# EAGLE design Grove_IMU 9DOF v1.0 (EAGLE 6.4)
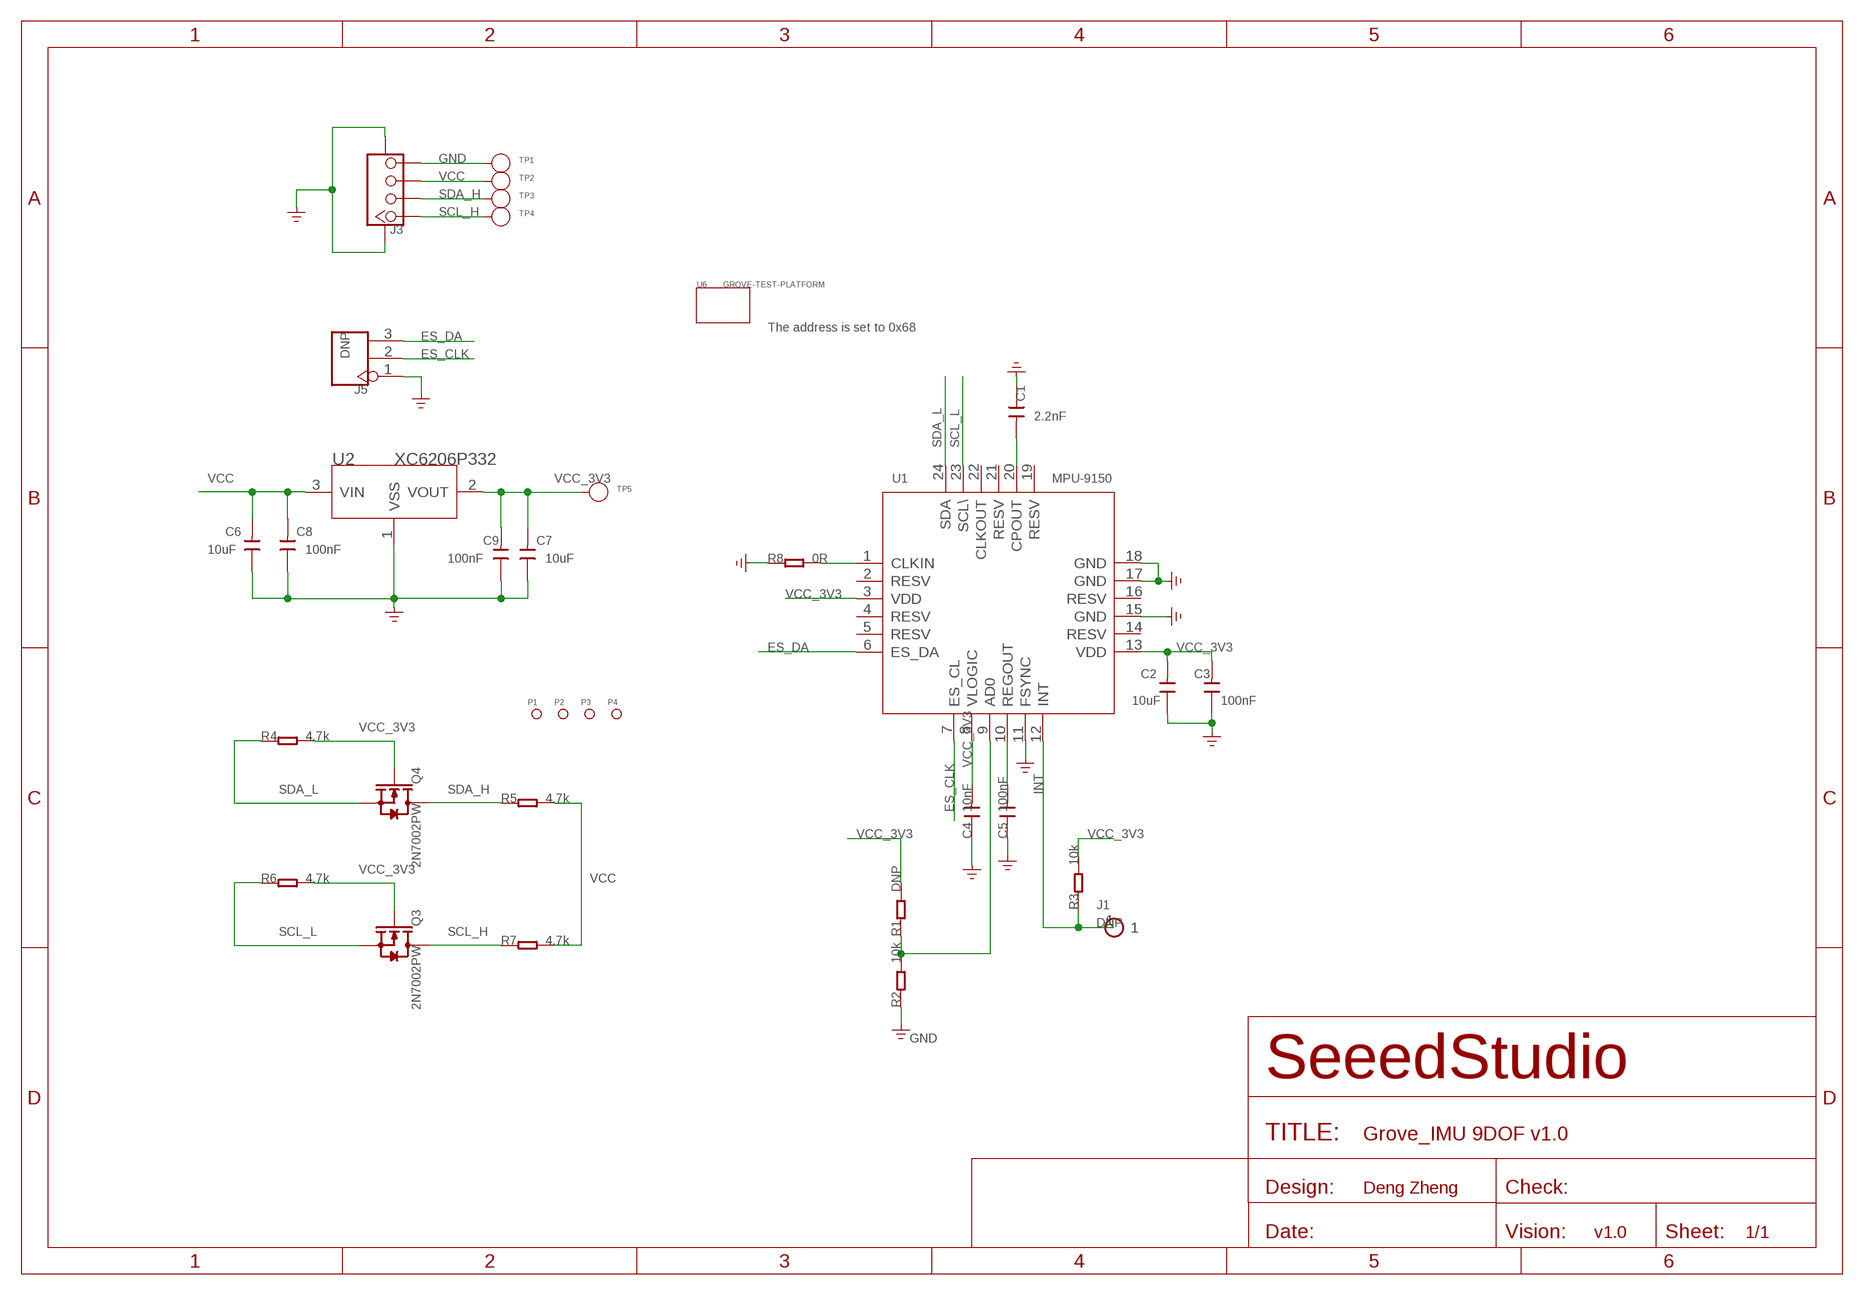
[diagram p0: schematic, sheet 1]

## Parts
C1  2.2nF  C-0603  [C0603]
C2  10uF  C-0805  [C0805]
C3  100nF  C-0603  [C0603]
C4  10nF  C-0603  [C0603]
C5  100nF  C-0603  [C0603]
C6  10uF  C-0805  [C0805]
C7  10uF  C-0805  [C0805]
C8  100nF  C-0603  [C0603]
C9  100nF  C-0603  [C0603]
J1  DNP  HEADER-1P-35  [1P-65/35MIL]
J3  TWIG-4P-2.0-SMD-FEMALE-REINFORCE'90D'  [4P-SMD-2.0-90D]
J5  DNP  HEADER-3P-2.54  [3P-2.54]
P1  PAD-MARK  [ROUND-MARK-1.0]
P2  PAD-MARK  [ROUND-MARK-1.0]
P3  PAD-MARK  [ROUND-MARK-1.0]
P4  PAD-MARK  [ROUND-MARK-1.0]
Q3  2N7002PW  MOSFET-N'SI1304BDL'  [SOT323]
Q4  2N7002PW  MOSFET-N'SI1304BDL'  [SOT323]
R1  DNP  R-0603  [R0603]
R2  10k  R-0603  [R0603]
R3  10k  R-0603  [R0603]
R4  4.7k  R-0603  [R0603]
R5  4.7k  R-0603  [R0603]
R6  4.7k  R-0603  [R0603]
R7  4.7k  R-0603  [R0603]
R8  0R  R-0603  [R0603]
TP1  PAD-TEST-POINT'4545'  [TP_4545]
TP2  PAD-TEST-POINT'4545'  [TP_4545]
TP3  PAD-TEST-POINT'4545'  [TP_4545]
TP4  PAD-TEST-POINT'4545'  [TP_4545]
TP5  PAD-TEST-POINT'4545'  [TP_4545]
U1  MPU-9150  [LGA-24]
U2  XC6206P332  XC6206MR  [SOT23]
U6  GROVE-TEST-PLATFORM  TWIG'2U'  [GROVE-TEST-PLATFORM]

## Nets
ES_CLK: J5.2 U1.7(ES_CL)
ES_DA: J5.3 U1.6(ES_DA)
GND: C1.1 C2.1 C3.1 C4.1 C5.1 C6.1 C7.1 C8.1 C9.1 J3.4 J3.SS1 J3.SS2 J5.1 R8.1 TP1.T U1.11(FSYNC) U1.15(GND) U1.17(GND) U1.18(GND) U2.1(VSS)
INT: J1.1 R3.1 U1.12(INT)
N$1: R1.1 R2.2 U1.9(AD0)
N$2: C1.2 U1.20(CPOUT)
N$4: R8.2 U1.1(CLKIN)
N$5: C5.2 U1.10(REGOUT)
SCL_H: J3.1 Q3.3(D) R7.1 TP4.T
SCL_L: Q3.2(S) R6.1 U1.23(SCL\)
SDA_H: J3.2 Q4.3(D) R5.1 TP3.T
SDA_L: Q4.2(S) R4.1 U1.24(SDA)
VCC: C6.2 C8.2 J3.3 R5.2 R7.2 TP2.T U2.3(VIN)
VCC_3V3: C2.2 C3.2 C4.2 C7.2 C9.2 Q3.1(G) Q4.1(G) R1.2 R3.2 R4.2 R6.2 TP5.T U1.3(VDD) U1.8(VLOGIC) U1.13(VDD) U2.2(VOUT)
Unconnected: R2.1 U1.2(RESV) U1.4(RESV) U1.5(RESV) U1.14(RESV) U1.16(RESV) U1.19(RESV) U1.21(RESV) U1.22(CLKOUT)

## Notes on the sheet
- The address is set to 0x68
- Deng Zheng
- v1.0

## Library data of the parts
C1-C9 = Discrete:C*: Ceramic Capacitors
J1 = Connector :HEADER-1P
J3 = Connector :TWIG-4P-2.0-SMD-FEMALE-REINFORCE
J5 = Connector :HEADER-3P
P1-P4 = Discrete:PAD-MARK; PARTNO: DNP
Q3 Q4 = Discrete:MOSFET-N: IRLL014: http://www.vishay.com/docs/91319/sihll014.pdf
R1-R8 = Discrete:R*
TP1-TP5 = Discrete:PAD-TEST-POINT; PARTNO: DNP
U1 = template:MPU-9150
U2 = IC:XC6206: LOW ESR Cap.Compatible Positive Voltage Regulators
U6 = template:TWIG

## Net classes
0 default: width 0.152 mm, drill 0.305 mm, clearance 0.152 mm
1 GND: width 0.152 mm, drill 0.305 mm, clearance 0.152 mm to class 0, clearance 0.152 mm

## Board
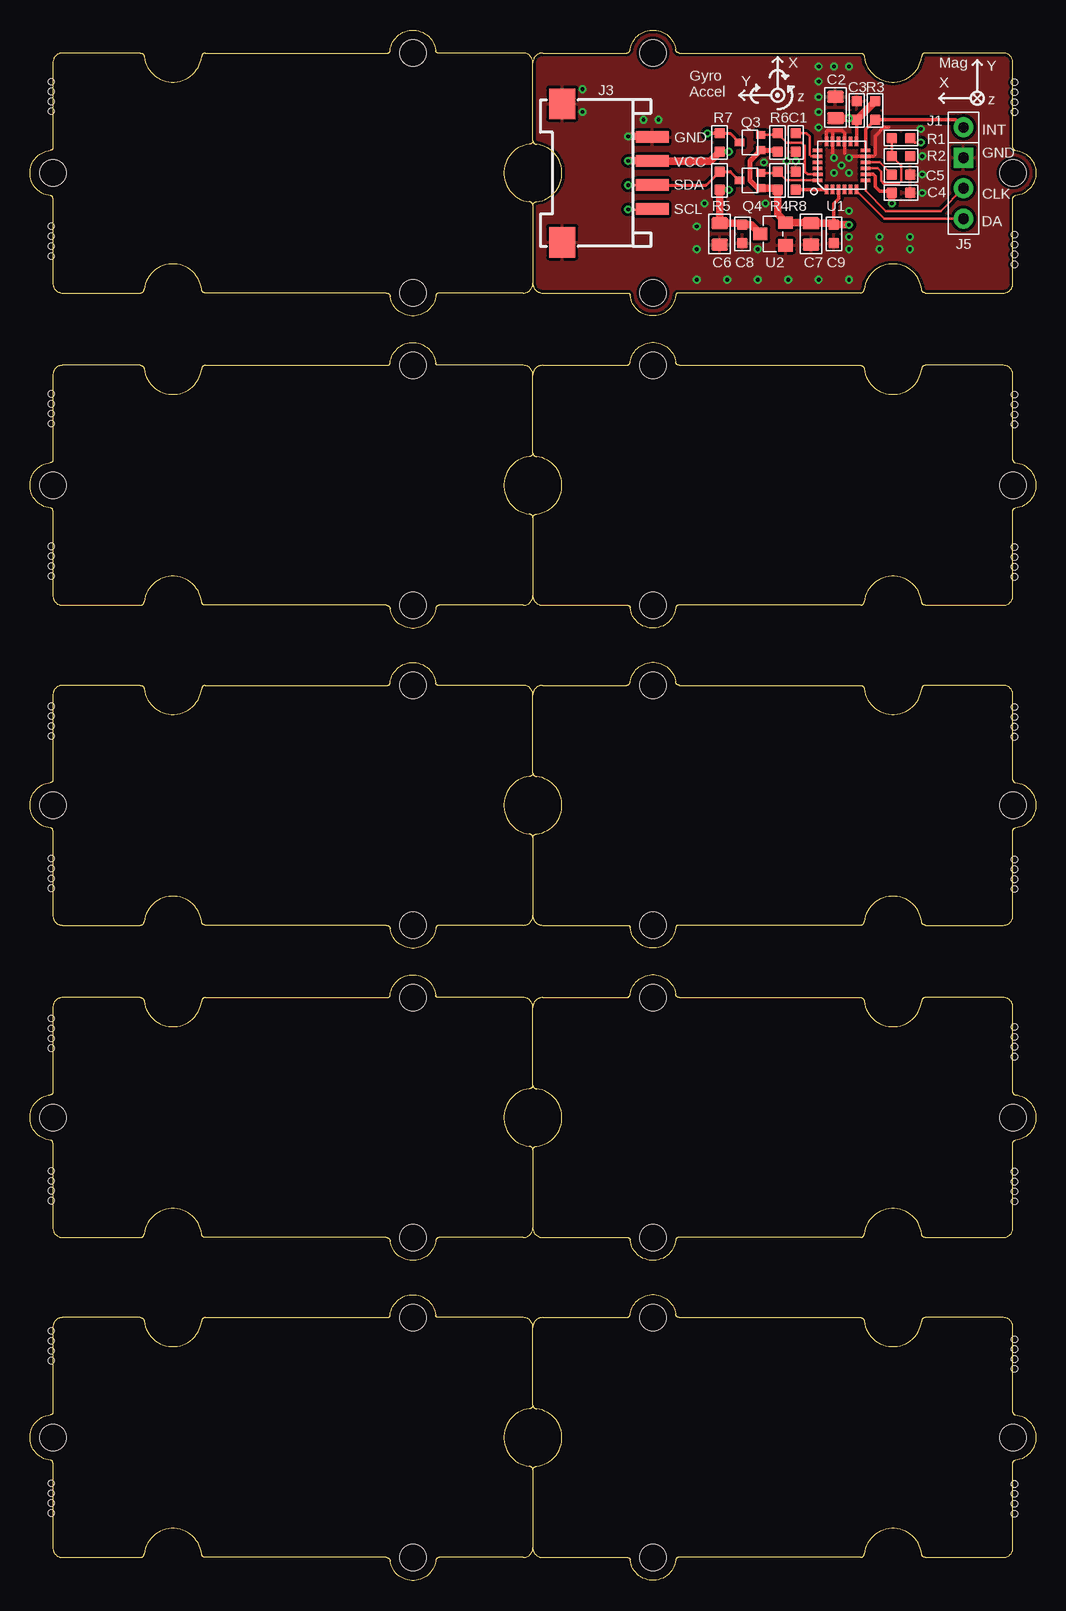
[diagram p1: board, top side]
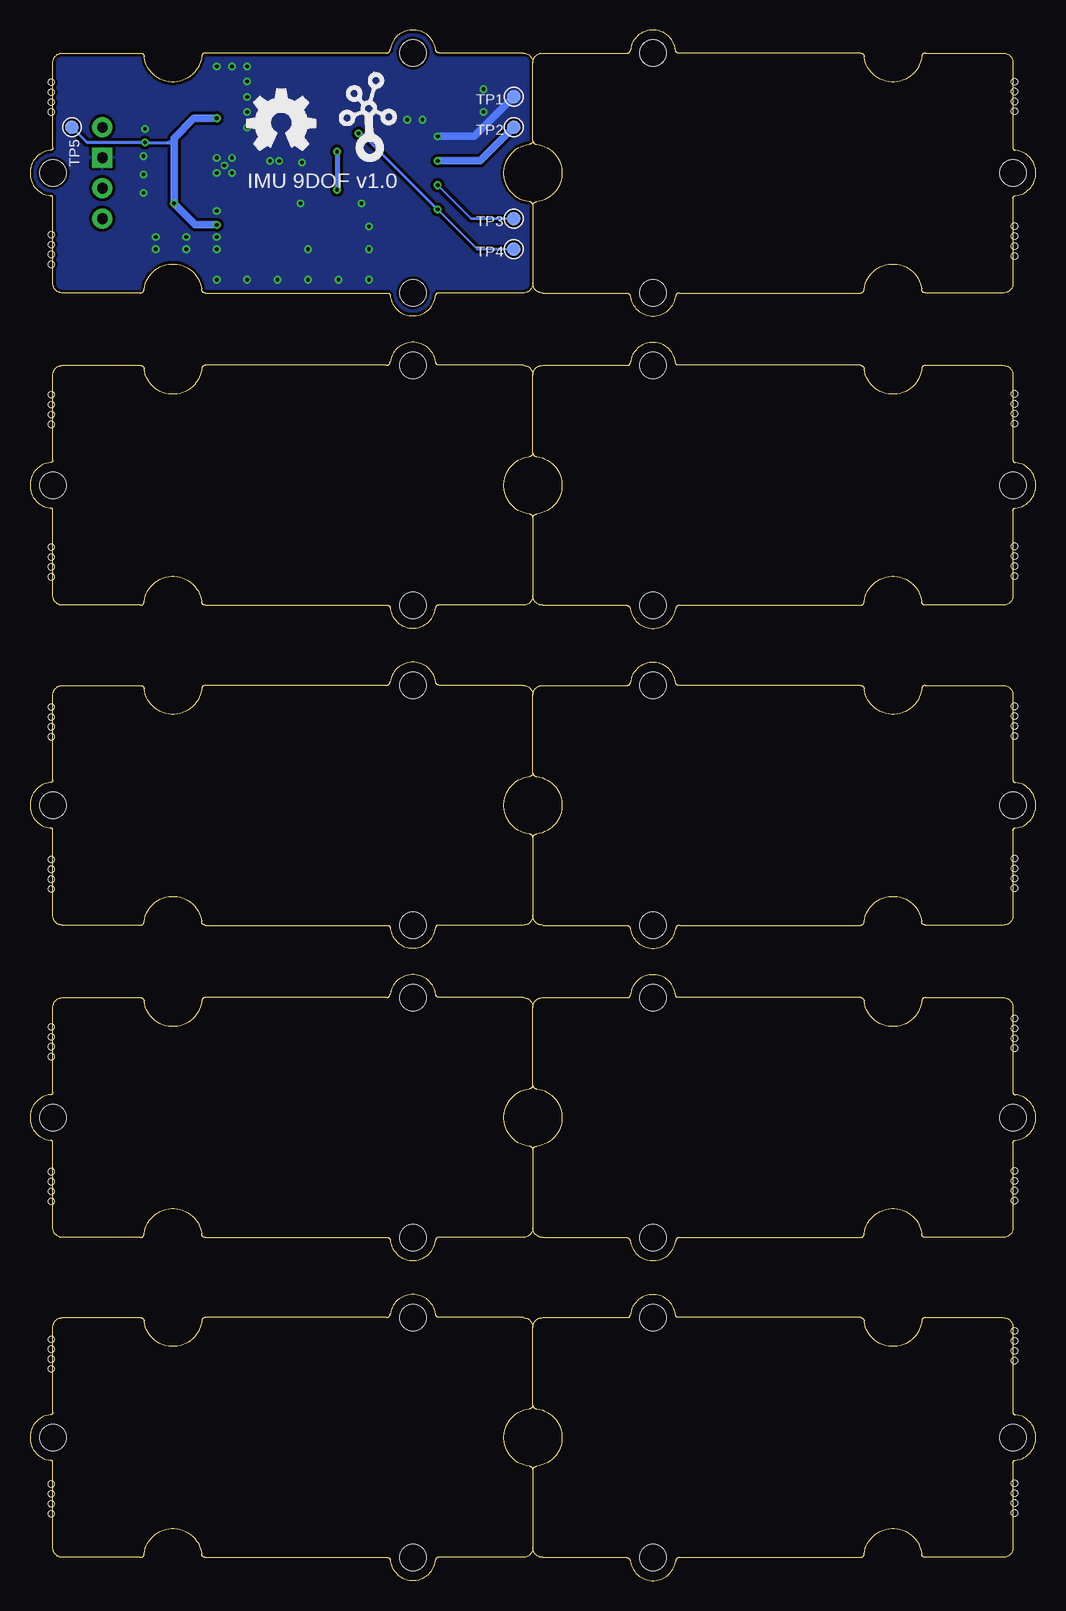
[diagram p2: board, bottom side, seen from below]

Size 83.82 x 129.25 mm. Coordinates in mm from the lower left corner, seen from the top.
Copper layers (1*16): Top 0.035mm / dielectric 1.5mm / Bottom 0.035mm
Design rules "SeeedStudio_rule_no_angle_090911 *": minimum track width 6mil, minimum drill 12mil, track to track 6mil, track to pad 6mil, pad to pad 6mil, via to via 6mil, smd to smd 0mil, copper to edge 10mil, drill to drill 10mil, minimum pad ring 10mil, minimum via ring 6mil, stop-mask expansion 2mil, vias tented up to drill 100mil, thermal gap 10mil
Holes 0.5 mm at 1.78,34.15 1.78,31.67 1.78,32.5 1.78,33.32 1.78,46.85 1.78,44.37 1.78,45.2 1.78,46.02 1.78,60.18 1.78,57.7 1.78,58.53 1.78,59.36 1.78,72.88 1.78,70.4 1.78,71.23 1.78,72.06 1.78,86.22 1.78,83.74 1.78,84.57 1.78,85.39 1.78,98.92 1.78,96.44 1.78,97.27 1.78,98.09 1.78,112.89 1.78,110.41 1.78,111.24 1.78,112.06 1.78,124.95 1.78,122.47 1.78,123.3 1.78,124.13 82.04,122.41 82.04,124.89 82.04,124.06 82.04,123.24 82.04,109.71 82.04,112.19 82.04,111.36 82.04,110.54 82.04,96.38 82.04,98.85 82.04,98.03 82.04,97.2 82.04,83.68 82.04,86.15 82.04,85.33 82.04,84.5 82.04,70.34 82.04,72.82 82.04,71.99 82.04,71.17 82.04,57.64 82.04,60.12 82.04,59.29 82.04,58.47 82.04,43.67 82.04,46.15 82.04,45.32 82.04,44.5 82.04,31.61 82.04,34.08 82.04,33.26 82.04,32.43 1.78,8.11 1.78,5.63 1.78,6.46 1.78,7.29 1.78,20.81 1.78,18.33 1.78,19.16 1.78,19.99 82.04,17.64 82.04,20.11 82.04,19.29 82.04,18.46 82.04,5.57 82.04,8.05 82.04,7.22 82.04,6.4
Holes 1.91 mm at -4.13,3.67 87.95,3.67 87.95,126.86 -4.13,126.86
tRestrict: area 66.4,119.7 to 66.9,120.3

### Footprints (pad centres in the part's own frame; a part is rotated, then mirrored left to right if it is on the bottom)
C0603 = smd 0.889 x 0.889: 1 -0.762,0; 2 0.762,0
C0805 = smd 1.016 x 1.397: 1 -0.889,0; 2 0.889,0
1P-65/35MIL = drill 0.889 pad 1.651: 1 0,0
4P-SMD-2.0-90D = smd 0.965 x 2.74: 1 -3,-0.1; 2 -1,-0.1; 3 1,-0.1; 4 3,-0.1 | smd 2.54 x 2.184: SS1 -5.771,7.4; SS2 5.771,7.4
3P-2.54 = drill 0.889 pad 1.651 square: 1 0,2.54 | drill 0.889 pad 1.651: 2 0,0; 3 0,-2.54
ROUND-MARK-1.0 = smd 1.016 x 1.016: P$1 0,0
SOT323 = smd 0.635 x 0.762: 1 -0.635,-0.889; 2 0.635,-0.889; 3 0,0.889
R0603 = smd 0.889 x 0.889: 1 -0.762,0; 2 0.762,0
TP_4545 = smd 1.143 x 1.143: T 0,0
LGA-24 = smd 0.8 x 0.3: 1 -2,1.25; 2 -2,0.75; 3 -2,0.25; 4 -2,-0.25; 5 -2,-0.75; 6 -2,-1.25; 13 2,-1.25; 14 2,-0.75; 15 2,-0.25; 16 2,0.25; 17 2,0.75; 18 2,1.25 | smd 0.3 x 0.8: 7 -1.25,-2; 8 -0.75,-2; 9 -0.25,-2; 10 0.25,-2; 11 0.75,-2; 12 1.25,-2; 19 1.25,2; 20 0.75,2; 21 0.25,2; 22 -0.25,2; 23 -0.75,1.975; 24 -1.25,2
SOT23 = smd 1.016 x 1.2: 1 -0.95,-1.06; 2 0.95,-1.06; 3 0,1.06
GROVE-TEST-PLATFORM = hole 2.2: -10,-10; -10,10; 20,0

### Placement (x,y rotation side)
C1  63.82,119.87 90 top
C2  67.12,122.79 270 top
C3  68.9,122.54 270 top
C4  72.58,115.68 180 top
C5  72.58,117.2 180 top
C6  57.47,112.25 90 top
C7  65.09,112.25 90 top
C8  59.37,112.25 90 top
C9  66.99,112.25 90 top
J1  77.79,121.14 90 top
J3  51.75,117.33 90 top
J5  77.79,116.06 0 top
P1  -4.13,121.78 0 top  (outside the outline)
P2  87.95,121.78 0 top  (outside the outline)
P3  87.95,8.75 0 top  (outside the outline)
P4  -4.13,8.75 0 top  (outside the outline)
Q3  60.01,119.87 90 top
Q4  60.01,116.7 90 top
R1  72.58,120.25 0 top
R2  72.58,118.73 180 top
R3  70.42,122.54 90 top
R4  62.29,116.7 270 top
R5  57.47,116.7 270 top
R6  62.29,119.87 270 top
R7  57.47,119.87 270 top
R8  63.82,116.7 270 top
TP1  43.5,123.68 0 bottom
TP2  43.5,121.14 0 bottom
TP3  43.5,113.52 0 bottom
TP4  43.5,110.98 0 bottom
TP5  80.33,121.14 0 bottom
U1  67.63,117.97 90 top
U2  61.91,112.25 90 top
U3  GROVE-TEST-PLATFORM  [GROVE-TEST-PLATFORM]  61.91,117.33 0 top
U4  GROVE-TEST-PLATFORM  [GROVE-TEST-PLATFORM]  21.91,117.33 180 top
U5  GROVE-TEST-PLATFORM  [GROVE-TEST-PLATFORM]  21.91,91.3 180 top
U6  61.91,91.3 0 top
U7  GROVE-TEST-PLATFORM  [GROVE-TEST-PLATFORM]  21.91,64.63 180 top
U8  GROVE-TEST-PLATFORM  [GROVE-TEST-PLATFORM]  61.91,64.63 0 top
U9  GROVE-TEST-PLATFORM  [GROVE-TEST-PLATFORM]  21.91,38.59 180 top
U10  GROVE-TEST-PLATFORM  [GROVE-TEST-PLATFORM]  61.91,38.59 0 top
U11  GROVE-TEST-PLATFORM  [GROVE-TEST-PLATFORM]  21.91,11.92 180 top
U12  GROVE-TEST-PLATFORM  [GROVE-TEST-PLATFORM]  61.91,11.92 0 top
U$3  [OSHW_FILLX200_NOTEXT]  65.72,119.24 0 bottom
U$13  [TWIGLOGO]  55.56,119.24 0 bottom

### Tracks (layer width: path | path; a pad name or v marks a point on that pad's centre or on a via)
ES_CLK
  Top 0.203: U1.7 69.63,115.84 71.31,114.16 75.88,114.16 J5.2
ES_DA
  Top 0.203: J5.3 71.18,113.52 68.88,115.83 U1.6
GND  (via drill 0.3 pad 0.64)
  Top 0.305: 66.87,120.89 67.63,120.89 67.88,120.64 U1.15 67.88,118.99 67.88,118.98 | 66.87,120.89 66.49,120.89 66.36,120.76 66.36,119.99 U1.18 | 66.87,120.89 66.88,120.88 U1.17 66.88,118.99 66.87,118.98 | 71.57,121.14 71.16,121.14 70.42,120.4 70.42,118.86 70.28,118.72 U1.11 68.4,118.72 68.39,118.73
  Top 0.61: v49.85,120.38 51.81,120.38 J3.4
  Bottom 0.61: TP1.T 46.8,120.38 v49.85,120.38
  other vias: 63.82,118.35 63.06,118.35 61.15,118.22 55.56,110.98 60.64,110.98 55.56,112.89 56.2,114.79 61.28,114.79 55.56,108.44 58.1,108.44 60.64,108.44 63.18,108.44 65.72,108.44 68.26,108.44 68.26,110.98 65.72,121.14 65.72,122.41 65.72,123.68 74.36,118.73 68.26,114.16 65.72,124.95 68.26,126.22 65.72,126.22 66.99,126.22 67.63,117.97 66.99,118.6 68.26,118.6 66.99,117.33 68.26,117.33 74.36,117.2 74.36,115.68 73.34,112 70.8,112 68.26,112 70.8,110.98 74.23,121.01 73.34,110.98 51.12,121.78 52.39,121.78 46.04,122.41 46.04,124.32
  pour Bottom (isolate 0.254): 41.59,129.4 84.14,129.4 84.14,105.27 41.59,105.27
  pour Top (isolate 0.254): 41.59,129.4 84.14,129.4 84.14,105.27 41.59,105.27
INT
  Top 0.305: U1.12 69.63,120.98 R3.1 77.15,121.78 J1.1
N$1
  Top 0.203: U1.9 70.64,117.72 70.93,117.43 70.93,116.67 71.16,116.44 72.41,116.44 72.6,116.64 72.6,117.94 R2.2 R1.1
N$2
  Top 0.203: U1.20 65.1,118.72 64.96,118.86 64.96,120.38 64.71,120.63 C1.2
N$4
  Top 0.305: R8.2 66.35,115.93 U1.1
N$5
  Top 0.203: U1.10 70.81,118.22 C5.2
SCL_H  (via drill 0.3 pad 0.64)
  Top 0.203: v49.85,114.28 51.81,114.28 J3.1
  Top 0.254: R7.1 58.36,120.63 Q3.3
  Top 0.305: R7.1 v56.45,120.63
  Bottom 0.203: TP4.T 46.55,110.98 v49.85,114.28
  Bottom 0.254: v49.85,114.28 56.2,120.63 v56.45,120.63
SCL_L
  Top 0.203: U1.23 64.82,117.22 64.58,117.46 64.58,119.62 64.33,119.87 63.06,119.87 R6.1 62.17,120.51 Q3.2
SDA_H  (via drill 0.3 pad 0.64)
  Top 0.203: v49.85,116.32 51.84,116.32 J3.2
  Top 0.254: J3.2 56.34,116.33 R5.1 58.36,117.46 Q4.3
  Bottom 0.203: TP3.T 47.05,113.52 v49.85,116.32
SDA_L
  Top 0.203: Q4.2 62.17,117.33 R4.1 63.04,116.72 U1.24
VCC  (via drill 0.3 pad 0.64)
  Top 0.406: R7.2 v58.23,119.11 | v58.23,115.93 R5.2
  Top 0.61: R5.2 57.47,113.27 57.6,113.14 C6.2 59.25,113.14 C8.2 60.09,113.01 U2.3 | R7.2 56.69,118.33 J3.3 51.84,118.35 v49.85,118.35
  Bottom 0.406: v58.23,119.11 v58.23,115.93
  Bottom 0.61: TP2.T 46.29,118.35 v49.85,118.35
VCC_3V3  (via drill 0.3 pad 0.64)
  Top 0.203: v74.23,119.87 73.72,119.87 R1.2
  Top 0.305: C9.2 66.99,114.79 67.38,115.18 U1.3 | U1.13 68.88,121.76 C3.2 68.39,121.78 v68.26,121.9 | U1.8 70.28,117.22 70.42,117.08 70.42,116.19 70.8,115.81 71.69,115.81 C4.2
  Top 0.406: R6.2 62.17,119.24 Q3.1 60.01,118.35 60.01,116.7 60.64,116.06 Q4.1
  Top 0.61: C2.2 v68.26,121.9 68.77,121.9 C3.2 R3.2 | Q4.1 62.17,116.06 R4.2 62.29,113.88 U2.2 65.03,113.2 C7.2 66.87,113.14 C9.2 v68.26,113.01 | C4.2 v71.82,114.79
  Bottom 0.254: TP5.T 79.06,119.87 v74.23,119.87 72.33,119.87 72.2,119.87 | 72.2,119.87 71.95,119.87 71.82,120 | 72.2,119.87 71.95,120.13 | 72.2,119.87 71.95,119.62
  Bottom 0.61: v68.26,121.9 70.16,121.9 71.82,120.25 71.82,120 v71.82,114.79 70.04,113.01 v68.26,113.01

### Text on the board
tPlace: X | Mag | Y | Y | X | Gyro / Accel | z | z | GND | INT | VCC | GND | SDA | CLK | SCL | DA
bPlace: IMU 9DOF v1.0
tEnhance: Top Enhance 0.25~0.28mm
bEnhance: Bottom Enhance
bEnHoles: Holes on Bottom Enhance | All Holes are 70mil diameter